# EAGLE design reciever (EAGLE 9.6.2)
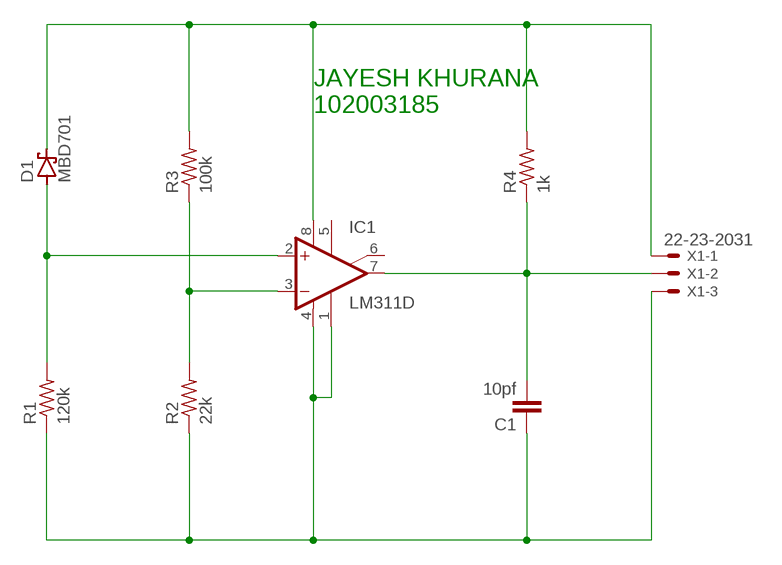
[diagram p0: schematic, sheet 1]

## Parts
C1  10pf  C2.5/2  [C2.5-2]
D1  MBD701  [TO92H]
IC1  LM311D  [SO08]
R1  120k  R-US_0207/10  [0207/10]
R2  22k  R-US_0207/10  [0207/10]
R3  100k  R-US_0207/10  [0207/10]
R4  1k  R-US_0207/10  [0207/10]
X1  22-23-2031  [22-23-2031]

## Nets
N$1: D1.2(C) IC1.8(V+) R3.2 R4.2 X1.1
N$2: C1.1 IC1.1(GND) IC1.4(V-) R1.1 R2.1 X1.3
N$3: D1.1(A) IC1.2(+IN) R1.2
N$4: IC1.3(-IN) R2.2 R3.1
N$5: C1.2 IC1.7(OUT) R4.1 X1.2
Unconnected: IC1.5(ON) IC1.6(ON/STR)

## Notes on the sheet
- JAYESH KHURANA
  102003185

## Library data of the parts
C1 = capacitor-wima:C: CAPACITOR naming: grid - package width
D1 = diode:MBD701: UHF DIODE
IC1 = linear:LM311: COMPARATOR
R1-R4 = rcl:R-US_: RESISTOR, American symbol; SPICEPREFIX: R
X1 = con-molex:22-23-2031: .100" (2.54mm) Center Header - 3 Pin; MF: MOLEX; MPN: 22-23-2031; OC_FARNELL: 1462950; OC_NEWARK: 30C0862

## Board
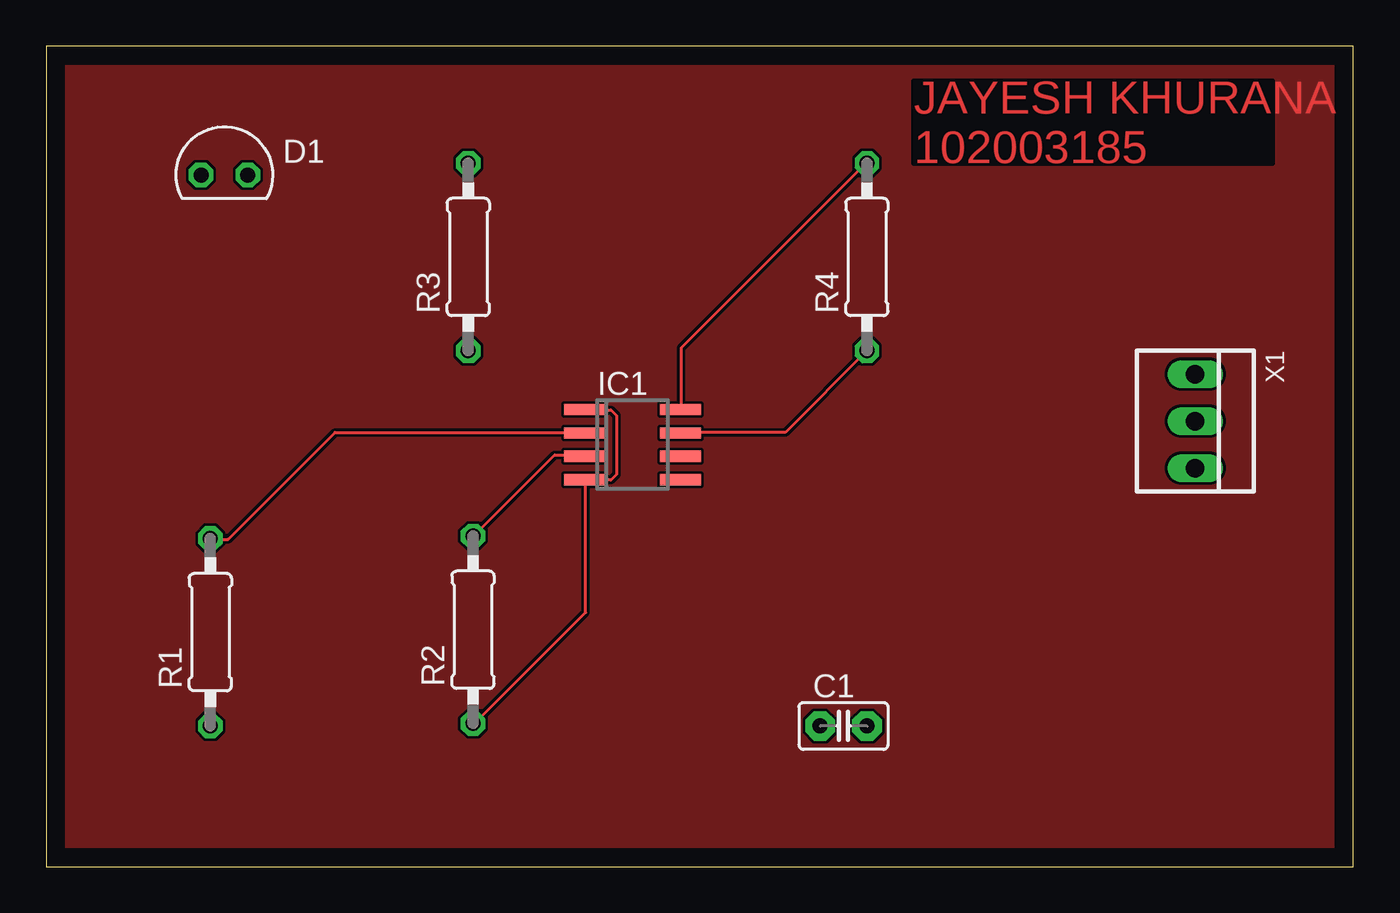
[diagram p1: board, top side]
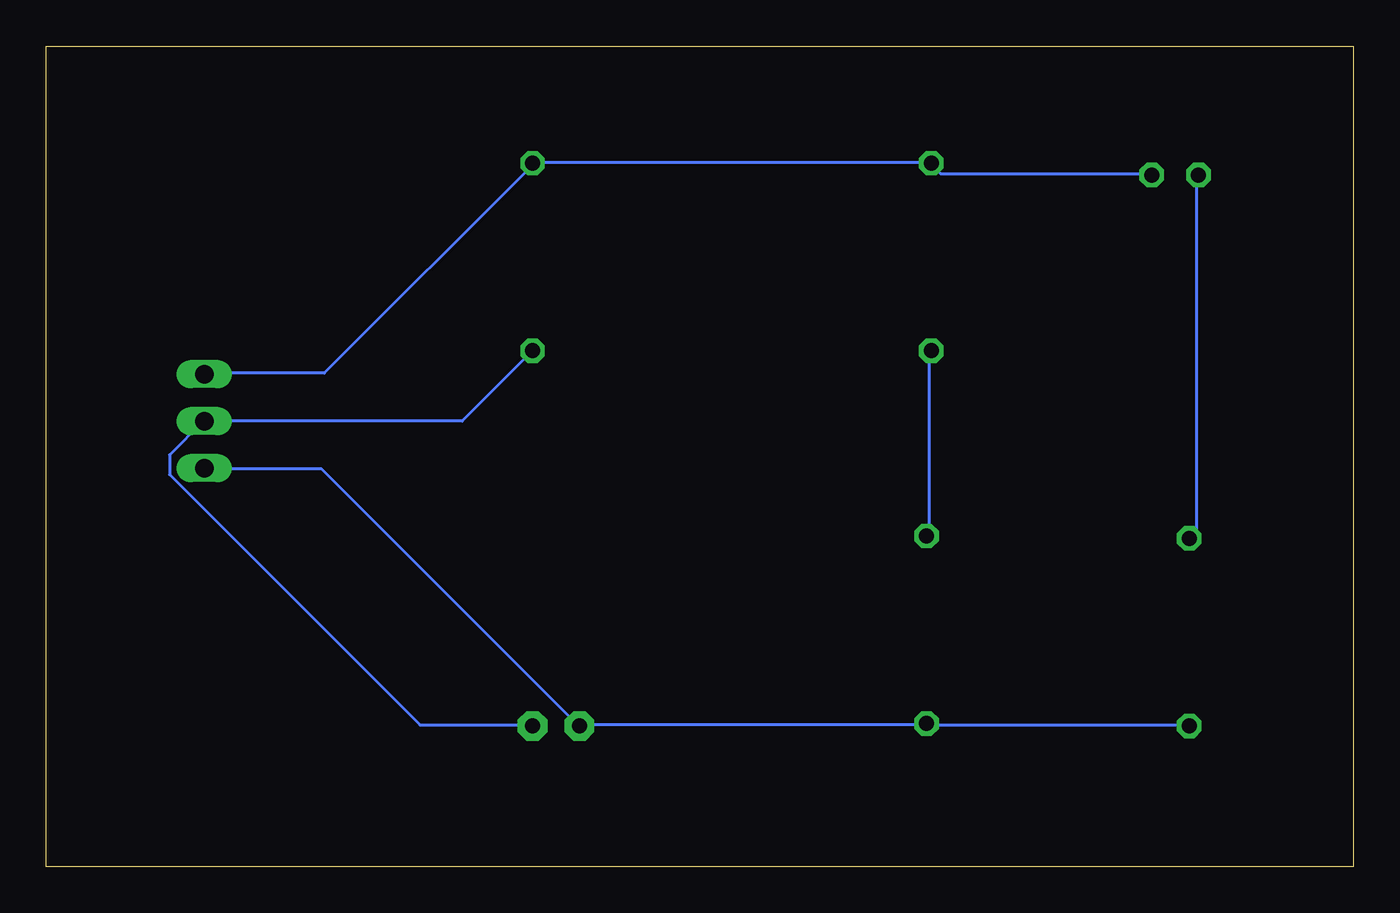
[diagram p2: board, bottom side, seen from below]

Size 70.79 x 44.44 mm. Coordinates in mm from the lower left corner, seen from the top.
Outline: 0,0 70.79,0 70.79,44.44 0,44.44 0,0
Copper layers (1*16): Top 0.035mm / dielectric 1.5mm / Bottom 0.035mm
Design rules "default": minimum track width 6mil, minimum drill 0.35mm, track to track 6mil, track to pad 6mil, pad to pad 6mil, via to via 6mil, smd to smd 6mil, copper to edge 40mil, drill to drill 6mil, minimum pad ring 10mil, minimum via ring 8mil, stop-mask expansion 4mil, vias tented up to drill 0mil, thermal gap 10mil

### Footprints (pad centres in the part's own frame; a part is rotated, then mirrored left to right if it is on the bottom)
C2.5-2 = drill 0.813 pad 1.6 octagon: 1 -1.27,0; 2 1.27,0
TO92H = drill 0.813 octagon: 1 -1.27,0; 2 1.27,0
SO08 = smd 0.6 x 2.2: 1 -1.905,-2.6; 2 -0.635,-2.6; 3 0.635,-2.6; 4 1.905,-2.6; 5 1.905,2.6; 6 0.635,2.6; 7 -0.635,2.6; 8 -1.905,2.6
0207/10 = drill 0.813 octagon: 1 -5.08,0; 2 5.08,0
22-23-2031 = drill 1 long: 1 -2.54,0; 2 0,0; 3 2.54,0

### Placement (x,y rotation side)
C1  43.18,7.62 0 top
D1  9.65,37.46 0 top
IC1  31.75,22.86 270 top
R1  8.89,12.7 90 top
R2  23.11,12.83 90 top
R3  22.86,33.02 90 top
R4  44.45,33.02 90 top
X1  62.23,24.13 270 top

### Tracks (layer width: path | path; a pad name or v marks a point on that pad's centre or on a via)
N$1
  Top 0.152: IC1.8 34.39,24.89 34.39,28.09 44.45,38.15 R4.2
  Bottom 0.152: D1.2 10.92,37.54 22.35,37.54 22.81,38 R3.2 22.96,38.15 44.45,38.15 R4.2 44.45,38 55.73,26.72 62.13,26.72 X1.1
N$2
  Top 0.152: 29.21,20.93 30.58,20.93 30.89,21.23 30.89,24.44 30.58,24.74 29.21,24.74 IC1.1 | 29.21,20.93 29.21,13.77 23.11,7.67 R2.1 | 29.21,20.93 IC1.4
  Bottom 0.152: X1.3 62.13,21.54 55.88,21.54 42.01,7.67 C1.1 41.86,7.67 23.11,7.67 | 23.11,7.67 8.94,7.67 R1.1 | 23.11,7.67 R2.1
N$3
  Top 0.152: IC1.2 29.06,23.52 15.65,23.52 9.86,17.73 8.94,17.73 R1.2
  Bottom 0.152: R1.2 8.48,18.19 8.48,37.39 D1.1
N$4
  Top 0.152: IC1.3 29.06,22.3 27.53,22.3 23.11,17.88 R2.2
  Bottom 0.152: R3.1 22.96,27.94 22.96,18.19 23.11,18.03 R2.2
N$5
  Top 0.152: R4.1 40.03,23.52 34.39,23.52 IC1.7
  Bottom 0.152: R4.1 48.26,24.13 X1.2 62.28,24.13 64.11,22.3 64.11,21.23 50.55,7.67 44.45,7.67 C1.2
N$6
  pour Top: 0,44.45 71.12,44.45 71.12,0 0,0

### Text on the board
Top: JAYESH KHURANA / 102003185